# EAGLE design ac-to-dc (EAGLE 6.6.0)
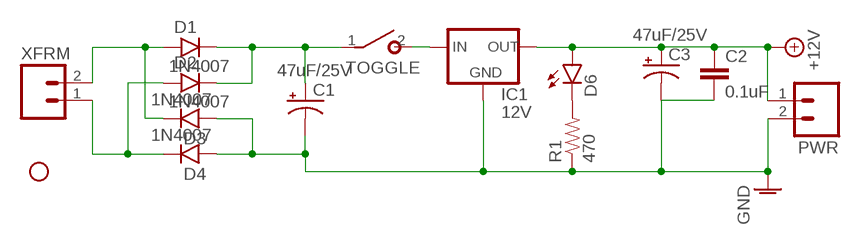
[diagram p0: schematic, sheet 1]

## Parts
C1  47uF/25V  CPOL-USE2.5-6  [E2,5-6]
C2  0.1uF  CAPPTH  [CAP-PTH-SMALL]
C3  47uF/25V  CPOL-USE2.5-6  [E2,5-6]
D1  1N4007  1N400X.3  [DO41-3]
D2  1N4007  1N400X.3  [DO41-3]
D3  1N4007  1N400X.3  [DO41-3]
D4  1N4007  1N400X.3  [DO41-3]
D6  LED-3MM-NO_SILK  [LED3MM-NS]
IC1  12V  78XXS  [78XXS]
JP1  STAND-OFF  [STAND-OFF]
PWR  M02PTH  [1X02]
R1  470  RESISTORPTH-1/4W  [AXIAL-0.4]
TOGGLE  SPST  [SPST]
XFRM  M02PTH  [1X02]

## Nets
+12V: C2.1 C3.+ D6.A IC1.OUT PWR.1
AGND: C1.- C2.2 C3.- D3.A D4.A IC1.GND PWR.2 R1.P$1 ; supply symbol labelled GND
N$1: IC1.IN TOGGLE.2(S)
N$2: D1.A D3.C XFRM.2
N$3: D2.A D4.C XFRM.1
N$4: D6.K(C) R1.P$2
N$9: C1.+ D1.C D2.C TOGGLE.1(P)

## Library data of the parts
C1 C3 = minimidi:CPOL-US: POLARIZED CAPACITOR, American symbol
C2 = SparkFun-Capacitors:CAP: Capacitor Standard 0603 ceramic capacitor, and 0.1" leaded capacitor.
D1-D4 = gm-diodes:1N400X: Rectifier Diodes often used in power supply to prevent damage from reverse polarization
D6 = SparkFun-LED:LED: LEDs Standard schematic elements and footprints for 5mm, 3mm, 1206, and 0603 sized LEDs. 5mm - Spark Fun Electronics SKU : COM-00529 (and others)
IC1 = v-reg:78XXS: VOLTAGE REGULATOR
JP1 = SparkFun:STAND-OFF: Stand Off This is the mechanical footprint for a #4 phillips button head screw. Use the keepout ring to avoid running the screw head into surrounding components. SKU : PRT-00447
PWR XFRM = SparkFun:M02: Header 2 Standard 2-pin 0.1" header. Use with straight break away headers (SKU : PRT-00116), right angle break away headers (PRT-00553), swiss pins (PRT-00743), machine pins (PRT-00117), and female headers (PRT-00115). Molex polarized connector foot print use with SKU : PRT-08233 with associated crimp pins and housings.
R1 = SparkFun-Resistors:RESISTOR: Resistor Basic schematic elements and footprints for 0603, 1206, and PTH resistors.
TOGGLE = gm-switches:SPST

## Net classes
1 power: width 0.61 mm

## Board
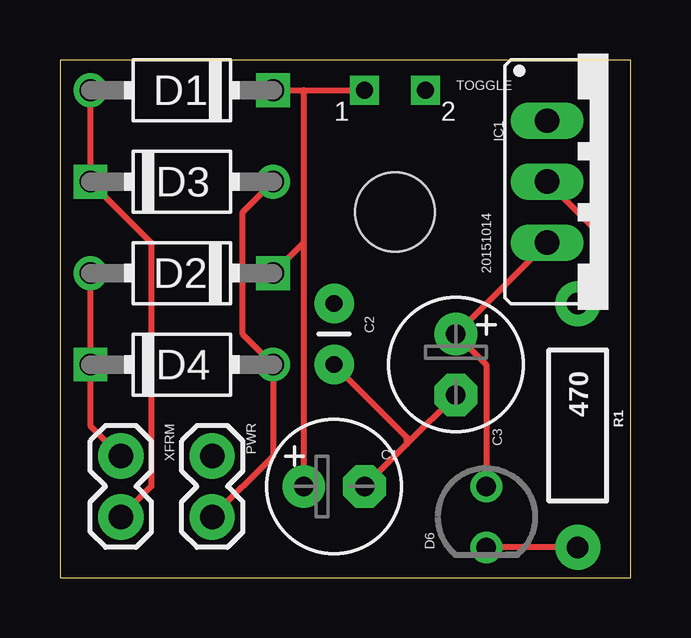
[diagram p1: board, top side]
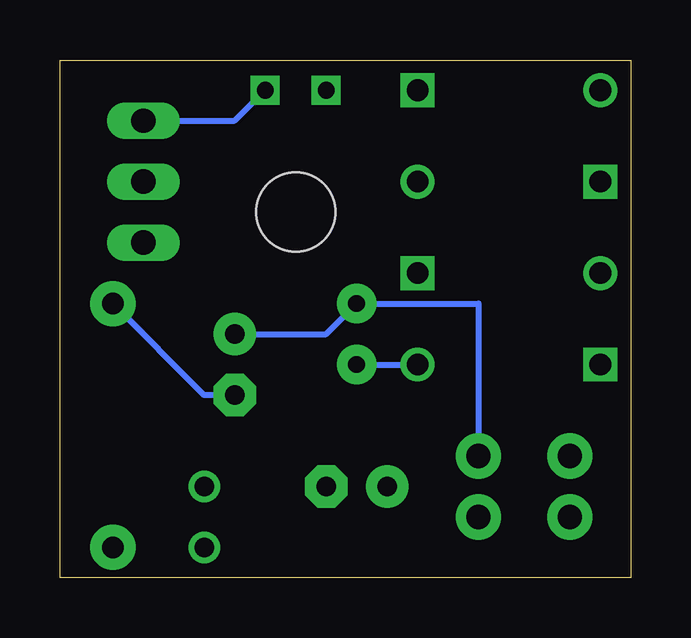
[diagram p2: board, bottom side, seen from below]

Size 23.8 x 21.58 mm. Coordinates in mm from the lower left corner, seen from the top.
Outline: 0,0 23.8,0 23.8,21.58 0,21.58 0,0
Copper layers (1*16): Top 0.035mm / dielectric 1.5mm / Bottom 0.035mm
Design rules "default": minimum track width 10mil, minimum drill 24mil, track to track 8mil, track to pad 8mil, pad to pad 8mil, via to via 8mil, smd to smd 8mil, copper to edge 40mil, drill to drill 8mil, minimum pad ring 10mil, minimum via ring 8mil, stop-mask expansion 4mil, vias tented up to drill 0mil, thermal gap 10mil

### Footprints (pad centres in the part's own frame; a part is rotated, then mirrored left to right if it is on the bottom)
E2,5-6 = drill 0.813 pad 1.778: + -1.27,0 | drill 0.813 pad 1.778 octagon: - 1.27,0
CAP-PTH-SMALL = drill 0.7 pad 1.651: 1 0,0; 2 2.54,0
DO41-3 = drill 0.9: A 3.81,0 | drill 0.9 square: C -3.81,0
LED3MM-NS = drill 0.813: A -1.27,0; K 1.27,0
78XXS = drill 1.016 long: GND 0,-2.54; IN -2.54,-2.54; OUT 2.54,-2.54
STAND-OFF = hole 3.302: 0,0
1X02 = drill 1.016 pad 1.88: 1 0,0; 2 2.54,0
AXIAL-0.4 = drill 0.9 pad 1.88: P$1 -5.08,0; P$2 5.08,0
SPST = drill 0.7 square: 1 -1.27,0; 2 1.27,0

### Placement (x,y rotation side)
C1  11.43,3.81 0 top
C2  11.43,11.43 270 top
C3  16.51,8.89 270 top
D1  5.08,20.32 180 top
D2  5.08,12.7 180 top
D3  5.08,16.51 0 top
D4  5.08,8.89 0 top
D6  17.78,2.54 270 top
IC1  22.86,16.51 270 top
JP1  13.97,15.24 0 top
PWR  6.35,5.08 270 top
R1  21.59,6.35 270 top
TOGGLE  13.97,20.32 0 top
XFRM  2.54,5.08 270 top

### Tracks (layer width: path | path; a pad name or v marks a point on that pad's centre or on a via)
+12V
  Top 0.254: D6.A 17.78,8.89 C3.+ IC1.OUT
  Bottom 0.254: C3.+ 12.7,10.16 C2.1 6.35,11.43 PWR.1
AGND
  Top 0.254: D3.A 7.62,15.24 7.62,10.16 D4.A 8.89,5.08 PWR.2 | IC1.GND 22.35,14.48 22.35,12.19 R1.P$1 | C3.- 14.48,5.59 | 14.48,5.59 C1.- | C2.2 14.48,5.84 14.48,5.59
  Bottom 0.254: C2.2 D4.A | R1.P$1 17.78,7.62 C3.-
N$1
  Bottom 0.254: TOGGLE.2 16.51,19.05 IC1.IN
N$2
  Top 0.254: D1.A D3.C 3.81,13.97 3.81,3.81 XFRM.2
N$3
  Top 0.254: D2.A D4.C 1.27,6.35 XFRM.1
N$4
  Top 0.254: R1.P$2 D6.K
N$9
  Top 0.254: D1.C 10.16,20.32 | 10.16,20.32 TOGGLE.1 | 10.16,13.97 D2.C | 10.16,20.32 10.16,13.97 | 10.16,13.97 C1.+

### Text on the board
tNames: 20151014